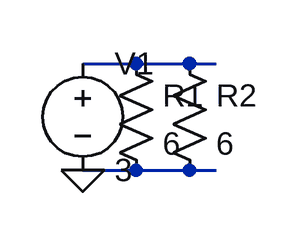
[diagram p0: schematic code.asc]
code.asc, the LTspice schematic file:
Version 4
SHEET 1 880 680
SYMBOL voltage 100 84 R0
SYMATTR InstName V1
SYMATTR Value 3
SYMBOL res 124 84 R0
SYMATTR InstName R1
SYMATTR Value 6
SYMBOL res 164 84 R0
SYMATTR InstName R2
SYMATTR Value 6
WIRE 100 100 200 100
WIRE 100 180 200 180
FLAG 100 180 0

The netlist it stands for:
* code.asc
V1 N001 0 3
R1 N001 0 6
R2 N001 0 6
.backanno
.end